# Altium project lilred_management_board.PrjPcb (part 2 of 2)

## Sheet current_sense.SchDoc
size Letter; CompanyName: Carnegie Mellon University; Organization: Carnegie Mellon University; Address1: Carnegie Mellon University; Address2: Robotics Institute; Address3: 5000 Forbes Ave., 4208 NSH; Address4: Pittsburgh, PA 15213; DocumentNumber: 4; Revision: 1.0; SheetNumber: 4; SheetTotal: 8; PageSetup: Record=PageOptions|CenterHorizontal=True|CenterVertical=True|PrintScale=1.00|XCorrection=1.00|YCorrection=1.00|PrintKind=0|BorderSize=5000000|LeftOffset=0|BottomOffset=0|Orientation=2|PaperLength=1000|PaperWidth=1000|Scale=100|PaperSource=7|PrintQuality=-4|MediaType=1|DitherType=10|PaperKind=Letter|PrintScaleMode=1
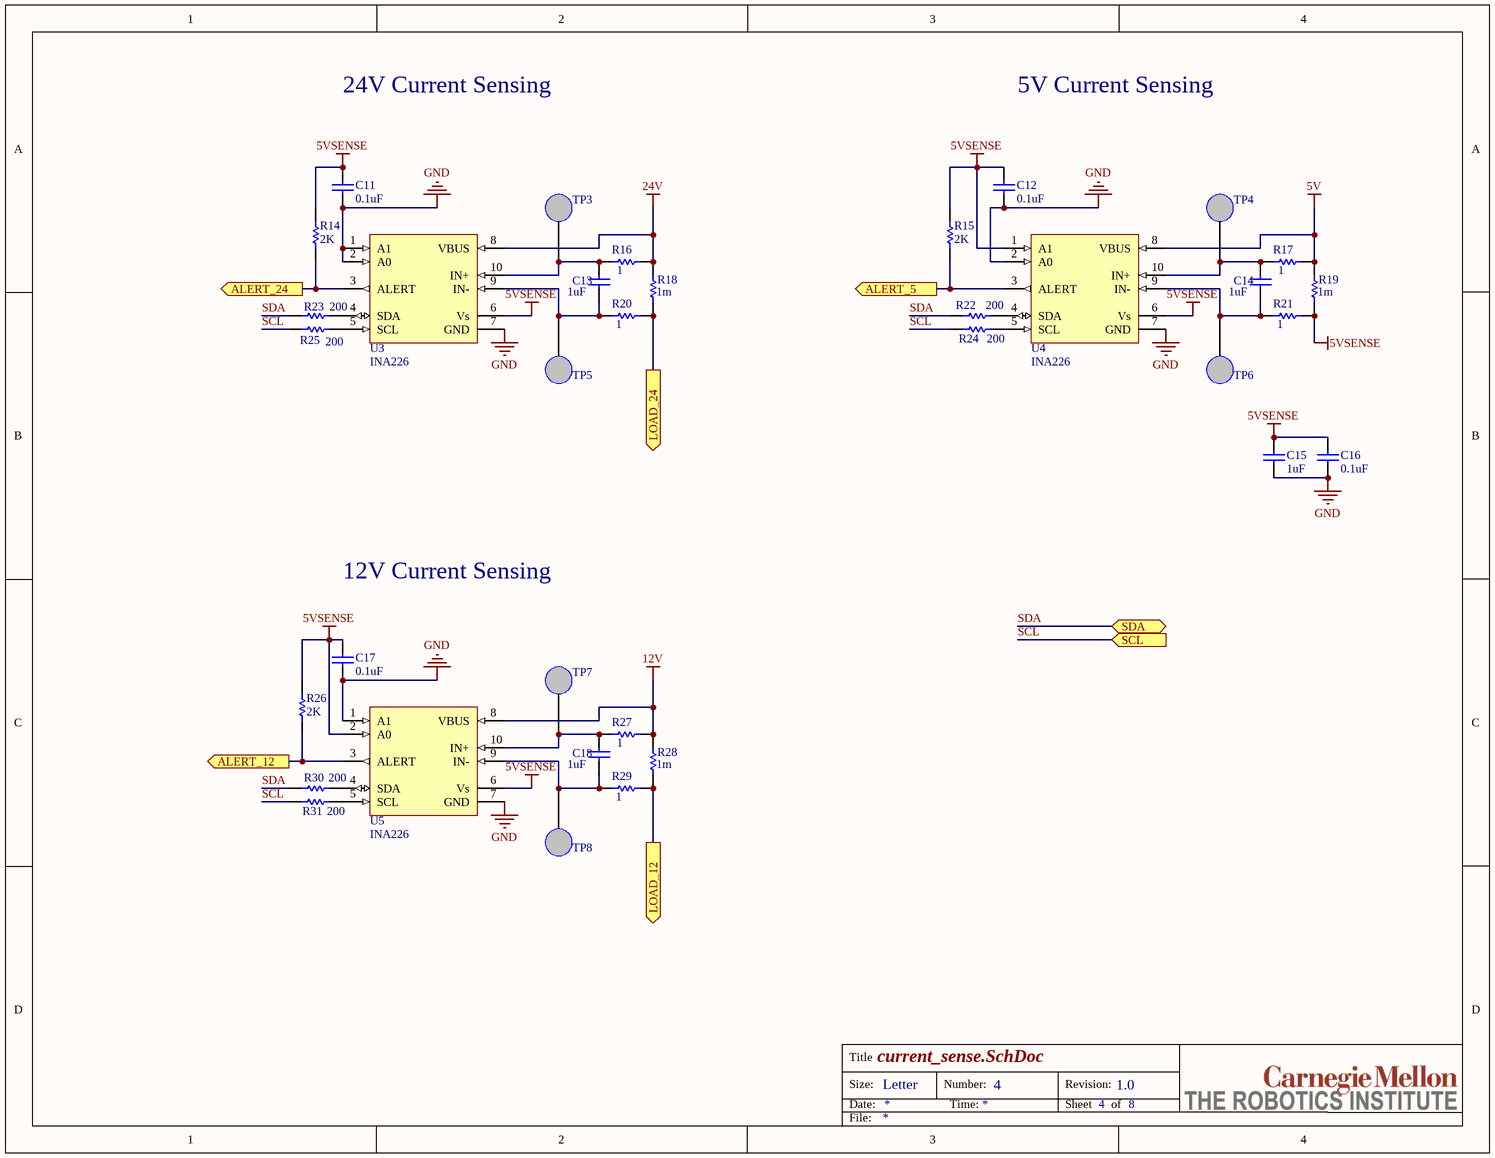
[diagram p2: current_sense.SchDoc]

### Parts
C11  value 0.1uF  [CAPC1608N]  (hidden comment: Bypass, 5V, 0.1uF)
C12  value 0.1uF  [CAPC1608N]  (hidden comment: Bypass, 5V, 0.1uF)
C13  1uF  [CAPC1608N]
C14  1uF  [CAPC1608N]
C15  value 1uF  [CAPC1608N]  (hidden comment: Bypass, 5V, 1uF)
C16  value 0.1uF  [CAPC1608N]  (hidden comment: Bypass, 5V, 0.1uF)
C17  value 0.1uF  [CAPC1608N]  (hidden comment: Bypass, 5V, 0.1uF)
C18  1uF  [CAPC1608N]
R14  2K  [RESC1608N]
R15  2K  [RESC1608N]
R16  1  [RESC1608N]
R17  1  [RESC1608N]
R18  value 1m  [RES5931]  (hidden comment: RSENSE, 24V, 1m)
R19  value 1m  [RESC3225N]  (hidden comment: RSENSE, 5V, 1m)
R20  1  [RESC1608N]
R21  1  [RESC1608N]
R22  200  [RESC1608N]
R23  200  [RESC1608N]
R24  200  [RESC1608N]
R25  200  [RESC1608N]
R26  2K  [RESC1608N]
R27  1  [RESC1608N]
R28  value 1m  [RESC3225N]  (hidden comment: RSENSE, 12V, 1m)
R29  1  [RESC1608N]
R30  200  [RESC1608N]
R31  200  [RESC1608N]
TP3  LOAD  [TestPoint]  (value not drawn)
TP4  SUPPLY  [TestPoint]  (value not drawn)
TP5  SUPPLY  [TestPoint]  (value not drawn)
TP6  LOAD  [TestPoint]  (value not drawn)
TP7  SUPPLY  [TestPoint]  (value not drawn)
TP8  LOAD  [TestPoint]  (value not drawn)
U3  INA226  [10-VSSOP]
U4  INA226  [10-VSSOP]
U5  INA226  [10-VSSOP]

### Ports
ALERT_5 (out), ALERT_12 (out), ALERT_24 (out), LOAD_12 (out), LOAD_24 (out), SCL (in), SDA (bidir)

### Nets
5V: R17.1 R19.2 U4.8(VBUS)
5VSENSE: C11.2 C12.2 C15.2 C16.2 C17.2 R14.1 R15.1 R19.1 R21.1 R26.1 U3.6(Vs) U4.1(A1) U4.6(Vs) U5.2(A0) U5.6(Vs)
12V: R27.1 R28.2 U5.8(VBUS)
24V: R16.1 R18.2 U3.8(VBUS)
GND: C11.1 C12.1 C15.1 C16.1 C17.1 U3.1(A1) U3.2(A0) U3.7(GND) U4.2(A0) U4.7(GND) U5.1(A1) U5.7(GND)
LOAD_12: R28.1 R29.1 ; port LOAD_12
LOAD_24: R18.1 R20.1 ; port LOAD_24
SCL: R24.2 R25.2 R31.2 ; port SCL
SDA: R22.2 R23.2 R30.2 ; port SDA
NetC13_1: C13.1 R16.2 TP3.1 U3.10(IN+)
NetC13_2: C13.2 R20.2 TP5.1 U3.9(IN-)
NetC14_1: C14.1 R17.2 TP4.1 U4.10(IN+)
NetC14_2: C14.2 R21.2 TP6.1 U4.9(IN-)
NetC18_1: C18.1 R27.2 TP7.1 U5.10(IN+)
NetC18_2: C18.2 R29.2 TP8.1 U5.9(IN-)
NetR14_2: R14.2 U3.3(ALERT) ; port ALERT_24
NetR15_2: R15.2 U4.3(ALERT) ; port ALERT_5
NetR22_1: R22.1 U4.4(SDA)
NetR23_1: R23.1 U3.4(SDA)
NetR24_1: R24.1 U4.5(SCL)
NetR25_1: R25.1 U3.5(SCL)
NetR26_2: R26.2 U5.3(ALERT) ; port ALERT_12
NetR30_1: R30.1 U5.4(SDA)
NetR31_1: R31.1 U5.5(SCL)

### Notes on the sheet
- 24V Current Sensing
- 5V Current Sensing
- 12V Current Sensing
- Title
- Size:
- Date:
- Letter
- Number:
- Time:
- Revision:
- Sheet
- of
- File:

### Library data of the parts
C11 C12 C16 C17 = Cap: Capacitor; Manufacturer: Murata Electronics North America; Manufacturer Part Number: GRM188R71H104JA93D; Description: CAP CER 0.1UF 50V X7R 0603; Capacitance: 0.10µF; Tolerance: ±5%; Voltage - Rated: 50V; Temperature Coefficient: X7R; Published: 8-Jun-2000; LatestRevisionDate: 17-Jul-2002; LatestRevisionNote: Re-released for DXP Platform.; PackageReference: RAD-0.3; Publisher: Altium Limited; PackageDescription: Radial Cap, Thru-Hole; 2 Leads; 0.3 in Pin Spacing; Supplier 1: Digi-Key; Supplier Part Number 1: 490-13406-1-ND; RoHS: RoHS Compliant; Category: Capacitors; Stock 1: 7465; Pricing 1: 1=0.11, 10=0.078, 50=0.0422, 100=0.0358, 250=0.02924, 500=0.02502, 1000=0.0195 (USD); Packaging: Cut Tape (CT); Mounting Type: Surface Mount, MLCC; Operating Temperature: -55°C ~ 125°C; Applications: General Purpose; Ratings: -; Package / Case: 0603 (1608 Metric); Size / Dimension: 0.063" L x 0.031" W (1.60mm x 0.80mm); Height - Seated (Max): -; Thickness (Max): 0.031" (0.80mm); Lead Spacing: -; Features: -; Lead Style: -; ComponentLink1URL: http://www.murata.com/~/media/webrenewal/support/library/catalog/products/capacitor/mlcc/c02e.pdf; ComponentLink1Description: http://www.murata.com/~/media/webrenewal/support/library/catalog/products/capacitor/mlcc/c02e.pdf
C13-C15 C18 = Cap: Capacitor; Manufacturer: Murata Electronics North America; Manufacturer Part Number: GRM188R61H105KAALD; Description: CAP CER 1UF 50V X5R 0603; Capacitance: 1µF; Tolerance: ±10%; Voltage - Rated: 50V; Temperature Coefficient: X5R; Published: 8-Jun-2000; LatestRevisionDate: 17-Jul-2002; LatestRevisionNote: Re-released for DXP Platform.; PackageReference: RAD-0.3; Publisher: Altium Limited; PackageDescription: Radial Cap, Thru-Hole; 2 Leads; 0.3 in Pin Spacing; Supplier 1: Digi-Key; Supplier Part Number 1: 490-10732-1-ND; RoHS: RoHS Compliant; Category: Capacitors; Stock 1: 59223; Pricing 1: 1=0.17, 10=0.12, 50=0.069, 100=0.057, 250=0.048, 500=0.0402, 1000=0.033 (USD); Packaging: Cut Tape (CT); Mounting Type: Surface Mount, MLCC; Operating Temperature: -55°C ~ 85°C; Applications: General Purpose; Ratings: -; Package / Case: 0603 (1608 Metric); Size / Dimension: 0.063" L x 0.031" W (1.60mm x 0.80mm); Height - Seated (Max): -; Thickness (Max): 0.035" (0.90mm); Lead Spacing: -; Features: -; Lead Style: -; ComponentLink1URL: http://www.murata.com/~/media/webrenewal/support/library/catalog/products/capacitor/mlcc/c02e.pdf; ComponentLink1Description: http://www.murata.com/~/media/webrenewal/support/library/catalog/products/capacitor/mlcc/c02e.pdf
  C13 C14 C18: Value: 1uF
R14 R15 R26 = Res1: Resistor; Manufacturer: Yageo; Manufacturer Part Number: RC0603JR-072KL; Description: RES SMD 2K OHM 5% 1/10W 0603; Tolerance: ±5%; Power (Watts): 0.1W, 1/10W; Temperature Coefficient: ±100ppm/°C; Published: 8-Jun-2000; LatestRevisionDate: 17-Jul-2002; LatestRevisionNote: Re-released for DXP Platform.; PackageReference: AXIAL-0.3; Publisher: Altium Limited; PackageDescription: Axial Device, Thru-Hole; 2 Leads; 0.3 in Pin Spacing; Value: 2K; Supplier 1: Digi-Key; Supplier Part Number 1: 311-2.0KGRCT-ND; RoHS: RoHS Compliant; Category: Resistors; Stock 1: 411222; Pricing 1: 1=0.1, 10=0.011, 25=0.008, 100=0.0044, 250=0.00336, 500=0.0027, 1000=0.00198, 2500=0.00172 (USD); Packaging: Cut Tape (CT); Resistance (Ohms): 2k; Composition: Thick Film; Features: Moisture Resistant; Operating Temperature: -55°C ~ 155°C; Package / Case: 0603 (1608 Metric); Supplier Device Package: 0603; Size / Dimension: 0.063" L x 0.031" W (1.60mm x 0.80mm); Height: 0.022" (0.55mm); Number of Terminations: 2; ComponentLink1URL: http://www.yageo.com/documents/recent/PYu-RC_Group_51_RoHS_L_04.pdf; ComponentLink1Description: http://www.yageo.com/documents/recent/PYu-RC_Group_51_RoHS_L_04.pdf
R16 R17 R20 R21 R27 R29 = Res1: Resistor; Manufacturer: Yageo; Manufacturer Part Number: RC0603FR-071RL; Description: RES SMD 1 OHM 1% 1/10W 0603; Tolerance: ±1%; Power (Watts): 0.1W, 1/10W; Temperature Coefficient: ±200ppm/°C; Published: 8-Jun-2000; LatestRevisionDate: 17-Jul-2002; LatestRevisionNote: Re-released for DXP Platform.; PackageReference: AXIAL-0.3; Publisher: Altium Limited; PackageDescription: Axial Device, Thru-Hole; 2 Leads; 0.3 in Pin Spacing; Value: 1; Supplier 1: Digi-Key; Supplier Part Number 1: 311-1.00HRCT-ND; RoHS: RoHS Compliant; Category: Resistors; Stock 1: 113321; Pricing 1: 1=0.1, 10=0.02, 25=0.0144, 100=0.0082, 250=0.00624, 500=0.00498, 1000=0.00367, 2500=0.00319 (USD); Packaging: Cut Tape (CT); Resistance (Ohms): 1; Composition: Thick Film; Features: Moisture Resistant; Operating Temperature: -55°C ~ 155°C; Package / Case: 0603 (1608 Metric); Supplier Device Package: 0603; Size / Dimension: 0.063" L x 0.031" W (1.60mm x 0.80mm); Height: 0.022" (0.55mm); Number of Terminations: 2; ComponentLink1URL: http://www.yageo.com/documents/recent/PYu-RC_Group_51_RoHS_L_04.pdf; ComponentLink1Description: http://www.yageo.com/documents/recent/PYu-RC_Group_51_RoHS_L_04.pdf
R18 = Res1: Resistor; Manufacturer: Rohm Semiconductor; Manufacturer Part Number: PSR500HTQFH1L00; Description: RES SMD 0.001 OHM 1% 5W 5931; Resistance (Ohms): 0.001; Tolerance: ±1%; Power (Watts): 5W; Temperature Coefficient: ±75ppm/°C; Published: 8-Jun-2000; LatestRevisionDate: 17-Jul-2002; LatestRevisionNote: Re-released for DXP Platform.; PackageReference: AXIAL-0.3; Publisher: Altium Limited; PackageDescription: Axial Device, Thru-Hole; 2 Leads; 0.3 in Pin Spacing; Supplier 1: Digi-Key; Supplier Part Number 1: RHM1683-CT-ND; RoHS: RoHS Compliant; Category: Resistors; Stock 1: 2625; Pricing 1: 1=1.96, 10=1.736, 25=1.61, 100=1.3259, 250=1.13652, 500=0.9471, 1000=0.82082 (USD); Packaging: Cut Tape (CT); Composition: Metal Element; Features: Automotive AEC-Q200, Current Sense; Operating Temperature: -55°C ~ 170°C; Package / Case: 5931; Supplier Device Package: 5931; Size / Dimension: 0.591" L x 0.305" W (15.00mm x 7.75mm); Height: -; Number of Terminations: 2; ComponentLink1URL: http://rohmfs.rohm.com/en/products/databook/datasheet/passive/resistor/chip_resistor/psr.pdf; ComponentLink1Description: http://rohmfs.rohm.com/en/products/databook/datasheet/passive/resistor/chip_resistor/psr.pdf
R19 R28 = Res1: Resistor; Manufacturer: Rohm Semiconductor; Manufacturer Part Number: PMR25HZPFV1L00; Description: RES SMD 0.001 OHM 1% 1W 1210; Resistance (Ohms): 0.001; Tolerance: ±1%; Power (Watts): 1W; Temperature Coefficient: ±100ppm/°C; Published: 8-Jun-2000; LatestRevisionDate: 17-Jul-2002; LatestRevisionNote: Re-released for DXP Platform.; PackageReference: AXIAL-0.3; Publisher: Altium Limited; PackageDescription: Axial Device, Thru-Hole; 2 Leads; 0.3 in Pin Spacing; Supplier 1: Digi-Key; Supplier Part Number 1: RHM.001APCT-ND; RoHS: RoHS Compliant; Category: Resistors; Stock 1: 2836; Pricing 1: 1=0.64, 10=0.535, 25=0.4588, 100=0.3593, 250=0.32108, 500=0.25994, 1000=0.21024 (USD); Packaging: Cut Tape (CT); Composition: Thick Film; Features: Automotive AEC-Q200, Current Sense; Operating Temperature: -55°C ~ 155°C; Package / Case: 1210 (3225 Metric); Supplier Device Package: 1210 (3225 Metric); Size / Dimension: 0.126" L x 0.098" W (3.20mm x 2.50mm); Height: 0.026" (0.67mm); Number of Terminations: 2; ComponentLink1URL: http://rohmfs.rohm.com/en/products/databook/datasheet/passive/resistor/chip_resistor/pmr.pdf; ComponentLink1Description: http://rohmfs.rohm.com/en/products/databook/datasheet/passive/resistor/chip_resistor/pmr.pdf
R22-R25 R30 R31 = Res1: Resistor; Manufacturer: Yageo; Manufacturer Part Number: RC0603JR-07200RL; Description: RES SMD 200 OHM 5% 1/10W 0603; Tolerance: ±5%; Power (Watts): 0.1W, 1/10W; Temperature Coefficient: ±100ppm/°C; Published: 8-Jun-2000; LatestRevisionDate: 17-Jul-2002; LatestRevisionNote: Re-released for DXP Platform.; PackageReference: AXIAL-0.3; Publisher: Altium Limited; PackageDescription: Axial Device, Thru-Hole; 2 Leads; 0.3 in Pin Spacing; Value: 200; Supplier 1: Digi-Key; Supplier Part Number 1: 311-200GRCT-ND; RoHS: RoHS Compliant; Category: Resistors; Stock 1: 267996; Pricing 1: 1=0.1, 10=0.011, 25=0.008, 100=0.0044, 250=0.00336, 500=0.0027, 1000=0.00198, 2500=0.00172 (USD); Packaging: Cut Tape (CT); Resistance (Ohms): 200; Composition: Thick Film; Features: Moisture Resistant; Operating Temperature: -55°C ~ 155°C; Package / Case: 0603 (1608 Metric); Supplier Device Package: 0603; Size / Dimension: 0.063" L x 0.031" W (1.60mm x 0.80mm); Height: 0.022" (0.55mm); Number of Terminations: 2; ComponentLink1URL: http://www.yageo.com/documents/recent/PYu-RC_Group_51_RoHS_L_04.pdf; ComponentLink1Description: http://www.yageo.com/documents/recent/PYu-RC_Group_51_RoHS_L_04.pdf
TP3-TP8 = Ring_Terminal: Test Point
U3-U5 = INA226: Current Shunt Monitor - I2C Interface; Manufacturer: Texas Instruments; Manufacturer Part Number: INA226AIDGSR; Description: IC MONITOR PWR/CURR BIDIR 10MSOP; Function: Current Monitor; Sensing Method: High/Low-Side; Accuracy: ±0.02%; Voltage - Input: 0 V ~ 36 V; Current - Output: 10mA; Supplier 1: Digi-Key; Supplier Part Number 1: 296-29034-1-ND; RoHS: RoHS Compliant; Category: Integrated Circuits (ICs); Stock 1: 16599; Pricing 1: 1=3.44, 10=3.087, 100=2.5326, 500=2.1546, 1000=1.575 (USD); Packaging: Cut Tape (CT); Operating Temperature: -40°C ~ 125°C; Mounting Type: Surface Mount; Package / Case: 10-TFSOP, 10-MSOP (0.118", 3.00mm Width); Supplier Device Package: 10-VSSOP; ComponentLink1URL: http://www.ti.com/lit/ds/symlink/ina226.pdf; ComponentLink1Description: http://www.ti.com/lit/ds/symlink/ina226.pdf

## Sheet thermal_monitor.SchDoc
size Letter; CompanyName: Carnegie Mellon University; Organization: Carnegie Mellon University; Address1: Carnegie Mellon University; Address2: Robotics Institute; Address3: 5000 Forbes Ave., 4208 NSH; Address4: Pittsburgh, PA 15213; DocumentNumber: 7; Revision: 1.0; SheetNumber: 7; SheetTotal: 8; PageSetup: Record=PageOptions|CenterHorizontal=True|CenterVertical=True|PrintScale=1.00|XCorrection=1.00|YCorrection=1.00|PrintKind=0|BorderSize=5000000|LeftOffset=0|BottomOffset=0|Orientation=2|PaperLength=1000|PaperWidth=1000|Scale=100|PaperSource=7|PrintQuality=-4|MediaType=1|DitherType=10|PaperKind=Letter|PrintScaleMode=1
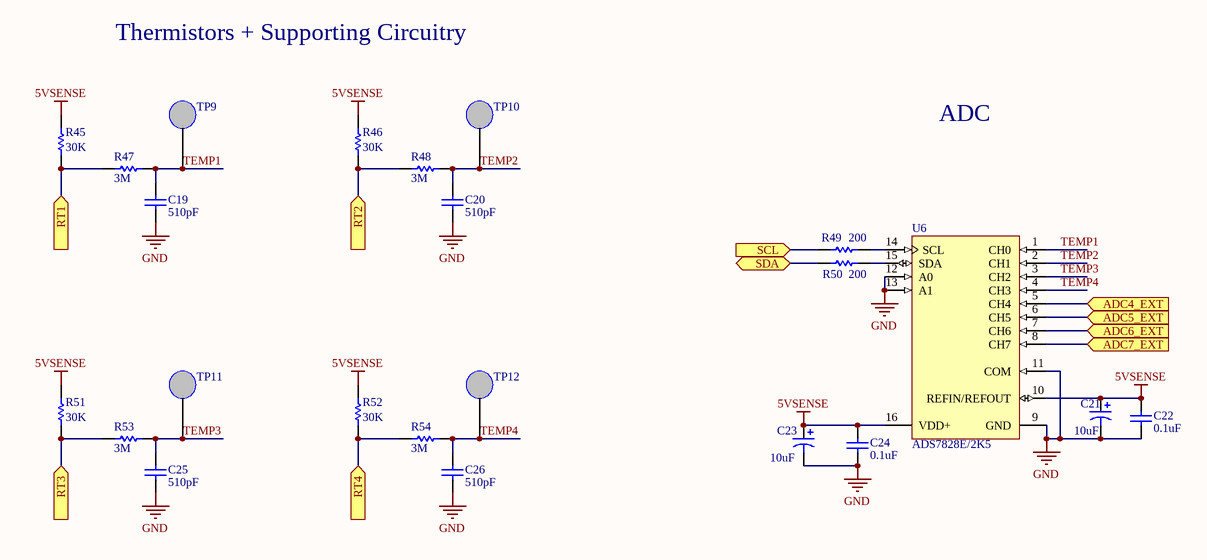
[diagram p3: thermal_monitor.SchDoc]

### Parts
C19  510pF  [CAPC1608N]
C20  510pF  [CAPC1608N]
C21  value 10uF  [CAPC2012N]  (hidden comment: Bypass Tanatalum, 5V, 10uF)
C22  value 0.1uF  [CAPC1608N]  (hidden comment: Bypass, 5V, 10nF)
C23  value 10uF  [CAPC2012N]  (hidden comment: Bypass Tantalum, 5V, 10uF)
C24  value 0.1uF  [CAPC1608N]  (hidden comment: Bypass, 5V, 10nF)
C25  510pF  [CAPC1608N]
C26  510pF  [CAPC1608N]
R45  value 30K  [RESC1608N]  (hidden comment: Therm_Rp, 30K)
R46  value 30K  [RESC1608N]  (hidden comment: Therm_Rp, 30K)
R47  3M  [RESC1608N]
R48  3M  [RESC1608N]
R49  200  [RESC1608N]
R50  200  [RESC1608N]
R51  value 30K  [RESC1608N]  (hidden comment: Therm_Rp, 30K)
R52  value 30K  [RESC1608N]  (hidden comment: Therm_Rp, 30K)
R53  3M  [RESC1608N]
R54  3M  [RESC1608N]
TP9  RT1  [TestPoint]  (value not drawn)
TP10  RT2  [TestPoint]  (value not drawn)
TP11  RT3  [TestPoint]  (value not drawn)
TP12  RT4  [TestPoint]  (value not drawn)
U6  ADS7828E/2K5  [TI-PW16_N]

### Ports
ADC4_EXT (in), ADC5_EXT (in), ADC6_EXT (in), ADC7_EXT (in), RT1 (in), RT2 (in), RT3 (in), RT4 (in), SCL (in), SDA (bidir)

### Nets
5VSENSE: C21.1 C22.2 C23.1 C24.2 R45.2 R46.2 R51.2 R52.2 U6.10(REFIN/REFOUT) U6.16(VDD+)
GND: C19.1 C20.1 C21.2 C22.1 C23.2 C24.1 C25.1 C26.1 U6.9(GND) U6.11(COM) U6.12(A0) U6.13(A1)
ADC4_EXT: U6.5(CH4) ; port ADC4_EXT
ADC5_EXT: U6.6(CH5) ; port ADC5_EXT
ADC6_EXT: U6.7(CH6) ; port ADC6_EXT
ADC7_EXT: U6.8(CH7) ; port ADC7_EXT
RT1: R45.1 R47.2 ; port RT1
RT2: R46.1 R48.2 ; port RT2
RT3: R51.1 R53.2 ; port RT3
RT4: R52.1 R54.2 ; port RT4
SCL: R49.1 ; port SCL
SDA: R50.1 ; port SDA
TEMP1: C19.2 R47.1 TP9.1 U6.1(CH0)
TEMP2: C20.2 R48.1 TP10.1 U6.2(CH1)
TEMP3: C25.2 R53.1 TP11.1 U6.3(CH2)
TEMP4: C26.2 R54.1 TP12.1 U6.4(CH3)
NetR49_2: R49.2 U6.14(SCL)
NetR50_2: R50.2 U6.15(SDA)

### Notes on the sheet
- Thermistors + Supporting Circuitry
- ADC
- Title
- Size:
- Date:
- Letter
- Number:
- Time:
- Revision:
- Sheet
- of
- File:

### Library data of the parts
C19 C20 C25 C26 = Cap: Capacitor; Manufacturer: Murata Electronics North America; Manufacturer Part Number: GRM1885C2A511JA01D; Description: CAP CER 510PF 100V NP0 0603; Tolerance: ±5%; Voltage - Rated: 100V; Temperature Coefficient: C0G, NP0; Published: 8-Jun-2000; LatestRevisionDate: 17-Jul-2002; LatestRevisionNote: Re-released for DXP Platform.; PackageReference: RAD-0.3; Publisher: Altium Limited; PackageDescription: Radial Cap, Thru-Hole; 2 Leads; 0.3 in Pin Spacing; Value: 510pF; Supplier 1: Digi-Key; Supplier Part Number 1: 490-1368-1-ND; RoHS: RoHS Compliant; Category: Capacitors; Stock 1: 12986; Pricing 1: 1=0.18, 10=0.122, 25=0.0916, 50=0.0702, 100=0.058, 250=0.0488, 500=0.04088, 1000=0.03355 (USD); Packaging: Cut Tape (CT); Capacitance: 510pF; Mounting Type: Surface Mount, MLCC; Operating Temperature: -55°C ~ 125°C; Applications: General Purpose; Ratings: -; Package / Case: 0603 (1608 Metric); Size / Dimension: 0.063" L x 0.031" W (1.60mm x 0.80mm); Height - Seated (Max): -; Thickness (Max): 0.035" (0.90mm); Lead Spacing: -; Features: -; Lead Style: -; ComponentLink1URL: http://www.murata.com/~/media/webrenewal/support/library/catalog/products/capacitor/mlcc/c02e.pdf; ComponentLink1Description: http://www.murata.com/~/media/webrenewal/support/library/catalog/products/capacitor/mlcc/c02e.pdf
C21 C23 = Cap Pol1: Polarized Capacitor (Radial); Manufacturer: AVX Corporation; Manufacturer Part Number: TACL106M010RTA; Manufacturer Size Code: L; Capacitance: 10µF; Tolerance: ±20%; Voltage - Rated: 10V; ESR (Equivalent Series Resistance): 7.5 Ohm; Type: Molded; Description: CAP TANT 10UF 6.3V 20% 0805; Published: 8-Jun-2000; LatestRevisionDate: 17-Jul-2002; LatestRevisionNote: Re-released for DXP Platform.; PackageReference: RB7.6-15; Publisher: Altium Limited; PackageDescription: Polarized Capacitor (Radial); 2 Leads; Supplier 1: Digi-Key; Supplier Part Number 1: 478-6230-1-ND; RoHS: RoHS Compliant; Category: Capacitors; Stock 1: 13074; Pricing 1: 1=2.24, 10=1.836, 100=1.2983, 250=1.07448, 500=0.96256, 1000=0.8954 (USD); Packaging: Cut Tape (CT); Operating Temperature: -55°C ~ 125°C; Mounting Type: Surface Mount; Package / Case: 0603 (1608 Metric); Size / Dimension: 0.063" L x 0.033" W (1.60mm x 0.85mm); Height - Seated (Max): 0.039" (1.00mm); Lead Spacing: -; Features: General Purpose; Lifetime @ Temp.: -; ComponentLink1URL: http://datasheets.avx.com/TAC.pdf; ComponentLink1Description: http://datasheets.avx.com/TAC.pdf; Supplier 2: Digi-Key; Supplier Part Number 2: 478-8115-1-ND; Stock 2: 38138; Pricing 2: 1=0.37, 10=0.312, 100=0.156, 250=0.117, 500=0.10336, 1000=0.09165 (USD); ComponentLink2URL: http://datasheets.avx.com/f92.pdf; ComponentLink2Description: http://datasheets.avx.com/f92.pdf
C22 C24 = Cap: as C11 on sheet current_sense; Published: 8-Jun-2000; LatestRevisionDate: 17-Jul-2002; LatestRevisionNote: Re-released for DXP Platform.; PackageReference: RAD-0.3; Publisher: Altium Limited; PackageDescription: Radial Cap, Thru-Hole; 2 Leads; 0.3 in Pin Spacing; Supplier 1: Digi-Key; Supplier Part Number 1: 490-13406-1-ND; RoHS: RoHS Compliant; Category: Capacitors; Stock 1: 7465; Pricing 1: 1=0.11, 10=0.078, 50=0.0422, 100=0.0358, 250=0.02924, 500=0.02502, 1000=0.0195 (USD); Packaging: Cut Tape (CT); Mounting Type: Surface Mount, MLCC; Operating Temperature: -55°C ~ 125°C; Applications: General Purpose; Ratings: -; Package / Case: 0603 (1608 Metric); Size / Dimension: 0.063" L x 0.031" W (1.60mm x 0.80mm); Height - Seated (Max): -; Thickness (Max): 0.031" (0.80mm); Lead Spacing: -; Features: -; Lead Style: -; ComponentLink1URL: http://www.murata.com/~/media/webrenewal/support/library/catalog/products/capacitor/mlcc/c02e.pdf; ComponentLink1Description: http://www.murata.com/~/media/webrenewal/support/library/catalog/products/capacitor/mlcc/c02e.pdf
R45 R46 R51 R52 = Res1: Resistor; Manufacturer: Yageo; Manufacturer Part Number: RT0603DRD0730KL; Description: RES SMD 30K OHM 0.5% 1/10W 0603; Tolerance: ±0.5%; Power (Watts): 0.1W, 1/10W; Temperature Coefficient: ±25ppm/°C; Published: 8-Jun-2000; LatestRevisionDate: 17-Jul-2002; LatestRevisionNote: Re-released for DXP Platform.; PackageReference: AXIAL-0.3; Publisher: Altium Limited; PackageDescription: Axial Device, Thru-Hole; 2 Leads; 0.3 in Pin Spacing; Supplier 1: Digi-Key; Supplier Part Number 1: 311-30KDCT-ND; RoHS: RoHS Compliant; Category: Resistors; Stock 1: 26965; Pricing 1: 1=0.22, 10=0.184, 25=0.134, 100=0.0721, 250=0.05532, 500=0.04358, 1000=0.03018, 2500=0.02766 (USD); Packaging: Cut Tape (CT); Resistance (Ohms): 30k; Composition: Thin Film; Features: Moisture Resistant; Operating Temperature: -55°C ~ 155°C; Package / Case: 0603 (1608 Metric); Supplier Device Package: 0603; Size / Dimension: 0.063" L x 0.031" W (1.60mm x 0.80mm); Height: 0.022" (0.55mm); Number of Terminations: 2; ComponentLink1URL: http://www.yageo.com/documents/recent/PYu-RT_1-to-0.05_RoHS_L_6.pdf; ComponentLink1Description: http://www.yageo.com/documents/recent/PYu-RT_1-to-0.05_RoHS_L_6.pdf
R47 R48 R53 R54 = Res1: Resistor; Manufacturer: Yageo; Manufacturer Part Number: RC0603JR-073ML; Description: RES SMD 3M OHM 5% 1/10W 0603; Tolerance: ±5%; Power (Watts): 0.1W, 1/10W; Temperature Coefficient: ±100ppm/°C; Published: 8-Jun-2000; LatestRevisionDate: 17-Jul-2002; LatestRevisionNote: Re-released for DXP Platform.; PackageReference: AXIAL-0.3; Publisher: Altium Limited; PackageDescription: Axial Device, Thru-Hole; 2 Leads; 0.3 in Pin Spacing; Value: 3M; Supplier 1: Digi-Key; Supplier Part Number 1: 311-3.0MGRCT-ND; RoHS: RoHS Compliant; Category: Resistors; Stock 1: 60830; Pricing 1: 1=0.1, 10=0.011, 25=0.008, 100=0.0044, 250=0.00336, 500=0.0027, 1000=0.00198, 2500=0.00172 (USD); Packaging: Cut Tape (CT); Resistance (Ohms): 3M; Composition: Thick Film; Features: Moisture Resistant; Operating Temperature: -55°C ~ 155°C; Package / Case: 0603 (1608 Metric); Supplier Device Package: 0603; Size / Dimension: 0.063" L x 0.031" W (1.60mm x 0.80mm); Height: 0.022" (0.55mm); Number of Terminations: 2; ComponentLink1URL: http://www.yageo.com/documents/recent/PYu-RC_Group_51_RoHS_L_04.pdf; ComponentLink1Description: http://www.yageo.com/documents/recent/PYu-RC_Group_51_RoHS_L_04.pdf
R49 R50 = Res1: as R22 on sheet current_sense; Published: 8-Jun-2000; LatestRevisionDate: 17-Jul-2002; LatestRevisionNote: Re-released for DXP Platform.; PackageReference: AXIAL-0.3; Publisher: Altium Limited; PackageDescription: Axial Device, Thru-Hole; 2 Leads; 0.3 in Pin Spacing; Value: 200; Supplier 1: Digi-Key; Supplier Part Number 1: 311-200GRCT-ND; RoHS: RoHS Compliant; Category: Resistors; Stock 1: 267996; Pricing 1: 1=0.1, 10=0.011, 25=0.008, 100=0.0044, 250=0.00336, 500=0.0027, 1000=0.00198, 2500=0.00172 (USD); Packaging: Cut Tape (CT); Resistance (Ohms): 200; Composition: Thick Film; Features: Moisture Resistant; Operating Temperature: -55°C ~ 155°C; Package / Case: 0603 (1608 Metric); Supplier Device Package: 0603; Size / Dimension: 0.063" L x 0.031" W (1.60mm x 0.80mm); Height: 0.022" (0.55mm); Number of Terminations: 2; ComponentLink1URL: http://www.yageo.com/documents/recent/PYu-RC_Group_51_RoHS_L_04.pdf; ComponentLink1Description: http://www.yageo.com/documents/recent/PYu-RC_Group_51_RoHS_L_04.pdf
TP9-TP12 = Ring_Terminal: Test Point
U6 = ADS7828E/2K5: 12-Bit 50 kSPS ADC I2C Low Power 8-Channel Multiplexer Internal 2.5 V Reference, -40 to 85 degC, 16-pin SOP (PW16), Green (RoHS & no Sb/Br); Manufacturer: Texas Instruments; Description: IC ADC 12BIT 50KSPS 8CH 16-TSSOP; Number of Bits: 12; Sampling Rate (Per Second): 50k; Number of Inputs: 8; Input Type: Differential, Single Ended; Data Interface: I²C; Configuration: MUX-S/H-ADC; Ratio - S/H:ADC: 1:1; Number of A/D Converters: 1; Architecture: SAR; Reference Type: External, Internal; Voltage - Supply, Analog: 2.7 V ~ 3.6 V, 5V; Supplier 1: Digi-Key; Supplier Part Number 1: 296-38856-1-ND; Manufacturer Part Number: ADS7828E/2K5; RoHS: RoHS Compliant By Exemption; Category: Integrated Circuits (ICs); Stock 1: 3104; Pricing 1: 1=7.39, 10=6.693, 100=5.5175, 500=4.824, 1000=3.76875 (USD); Packaging: Cut Tape (CT); Voltage - Supply, Digital: 2.7 V ~ 3.6 V, 5V; Features: -; Operating Temperature: -40°C ~ 85°C; Package / Case: 16-TSSOP (0.173", 4.40mm Width); Supplier Device Package: 16-TSSOP; ComponentLink1URL: http://www.ti.com/lit/ds/symlink/ads7828.pdf; ComponentLink1Description: http://www.ti.com/lit/ds/symlink/ads7828.pdf

## Sheet led_control.SchDoc
size Letter; CompanyName: Carnegie Mellon University; Organization: Carnegie Mellon University; Address1: Carnegie Mellon University; Address2: Robotics Institute; Address3: 5000 Forbes Ave., 4208 NSH; Address4: Pittsburgh, PA 15213; DocumentNumber: 5; Revision: 1.0; SheetNumber: 5; SheetTotal: 8; PageSetup: Record=PageOptions|CenterHorizontal=True|CenterVertical=True|PrintScale=1.00|XCorrection=1.00|YCorrection=1.00|PrintKind=0|BorderSize=5000000|LeftOffset=0|BottomOffset=0|Orientation=2|PaperLength=1000|PaperWidth=1000|Scale=100|PaperSource=7|PrintQuality=-4|MediaType=1|DitherType=10|PaperKind=Letter|PrintScaleMode=1
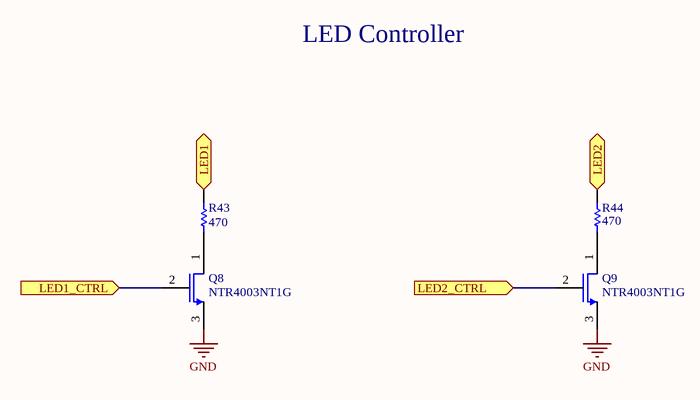
[diagram p4: led_control.SchDoc]

### Parts
Q8  NTR4003NT1G  [SOT-23]
Q9  NTR4003NT1G  [SOT-23]
R43  470  [RESC1608N]
R44  470  [RESC1608N]

### Ports
LED1 (in), LED1_CTRL (in), LED2 (in), LED2_CTRL (in)

### Nets
GND: Q8.3 Q9.3
LED1: R43.1 ; port LED1
LED2: R44.2 ; port LED2
NetQ8_1: Q8.1 R43.2
NetQ8_2: Q8.2 ; port LED1_CTRL
NetQ9_1: Q9.1 R44.1
NetQ9_2: Q9.2 ; port LED2_CTRL

### Notes on the sheet
- LED Controller
- Title
- Size:
- Date:
- Letter
- Number:
- Time:
- Revision:
- Sheet
- of
- File:

### Library data of the parts
Q8 Q9 = NTR4003NT1G: N-Channel MOSFET; pin to pad: 1>3 2>1 3>2; Manufacturer: ON Semiconductor; Description: MOSFET N-CH 30V 500MA SOT-23; FET Type: MOSFET N-Channel, Metal Oxide; FET Feature: Standard; Drain to Source Voltage (Vdss): 30V; Current - Continuous Drain (Id) @ 25°C: 500mA (Ta); Rds On (Max) @ Id, Vgs: 1.5 Ohm @ 10mA, 4V; Vgs(th) (Max) @ Id: 1.4V @ 250µA; Gate Charge (Qg) @ Vgs: 1.15nC @ 5V; Input Capacitance (Ciss) @ Vds: 21pF @ 5V; Power - Max: 690mW; Supplier 1: Digi-Key; Supplier Part Number 1: NTR4003NT1GOSCT-ND; Manufacturer Part Number: NTR4003NT1G; RoHS: RoHS Compliant; Category: Discrete Semiconductor Products; Stock 1: 65978; Pricing 1: 1=0.27, 10=0.223, 100=0.118, 500=0.07758, 1000=0.05286 (USD); Packaging: Cut Tape (CT); Operating Temperature: -55°C ~ 150°C (TJ); Mounting Type: Surface Mount; Package / Case: TO-236-3, SC-59, SOT-23-3; Supplier Device Package: SOT-23-3 (TO-236); ComponentLink1URL: http://www.onsemi.com/pub_link/Collateral/NTR4003N-D.PDF; ComponentLink1Description: http://www.onsemi.com/pub_link/Collateral/NTR4003N-D.PDF
R43 R44 = Res1: Resistor; Manufacturer: Yageo; Manufacturer Part Number: RC0603JR-07470RL; Description: RES SMD 470 OHM 5% 1/10W 0603; Tolerance: ±5%; Power (Watts): 0.1W, 1/10W; Temperature Coefficient: ±100ppm/°C; Published: 8-Jun-2000; LatestRevisionDate: 17-Jul-2002; LatestRevisionNote: Re-released for DXP Platform.; PackageReference: AXIAL-0.3; Publisher: Altium Limited; PackageDescription: Axial Device, Thru-Hole; 2 Leads; 0.3 in Pin Spacing; Value: 470; Supplier 1: Digi-Key; Supplier Part Number 1: 311-470GRCT-ND; RoHS: RoHS Compliant; Category: Resistors; Stock 1: 674624; Pricing 1: 1=0.1, 10=0.011, 25=0.008, 100=0.0044, 250=0.00336, 500=0.0027, 1000=0.00198, 2500=0.00172 (USD); Packaging: Cut Tape (CT); Resistance (Ohms): 470; Composition: Thick Film; Features: Moisture Resistant; Operating Temperature: -55°C ~ 155°C; Package / Case: 0603 (1608 Metric); Supplier Device Package: 0603; Size / Dimension: 0.063" L x 0.031" W (1.60mm x 0.80mm); Height: 0.022" (0.55mm); Number of Terminations: 2; ComponentLink1URL: http://www.yageo.com/documents/recent/PYu-RC_Group_51_RoHS_L_04.pdf; ComponentLink1Description: http://www.yageo.com/documents/recent/PYu-RC_Group_51_RoHS_L_04.pdf

## Sheet fan_control.SchDoc
size Letter; CompanyName: Carnegie Mellon University; Organization: Carnegie Mellon University; Address1: Carnegie Mellon University; Address2: Robotics Institute; Address3: 5000 Forbes Ave., 4208 NSH; Address4: Pittsburgh, PA 15213; DocumentNumber: 6; Revision: 1.0; SheetNumber: 6; SheetTotal: 8; PageSetup: Record=PageOptions|CenterHorizontal=True|CenterVertical=True|PrintScale=1.00|XCorrection=1.00|YCorrection=1.00|PrintKind=0|BorderSize=5000000|LeftOffset=0|BottomOffset=0|Orientation=2|PaperLength=1000|PaperWidth=1000|Scale=100|PaperSource=7|PrintQuality=-4|MediaType=1|DitherType=10|PaperKind=Letter|PrintScaleMode=1
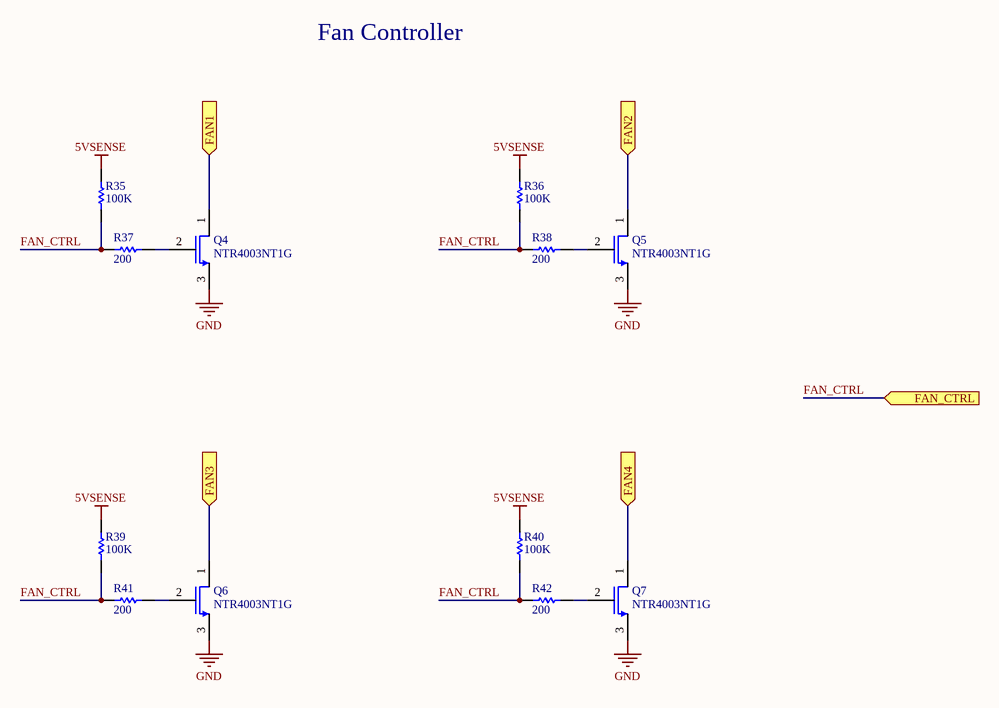
[diagram p5: fan_control.SchDoc]

### Parts
Q4  NTR4003NT1G  [SOT-23]
Q5  NTR4003NT1G  [SOT-23]
Q6  NTR4003NT1G  [SOT-23]
Q7  NTR4003NT1G  [SOT-23]
R35  100K  [RESC1608N]
R36  100K  [RESC1608N]
R37  200  [RESC1608N]
R38  200  [RESC1608N]
R39  100K  [RESC1608N]
R40  100K  [RESC1608N]
R41  200  [RESC1608N]
R42  200  [RESC1608N]

### Ports
FAN1 (in), FAN2 (in), FAN3 (in), FAN4 (in), FAN_CTRL (in)

### Nets
5VSENSE: R35.2 R36.2 R39.2 R40.2
GND: Q4.3 Q5.3 Q6.3 Q7.3
FAN1: Q4.1 ; port FAN1
FAN2: Q5.1 ; port FAN2
FAN3: Q6.1 ; port FAN3
FAN4: Q7.1 ; port FAN4
FAN_CTRL: R35.1 R36.1 R37.2 R38.2 R39.1 R40.1 R41.2 R42.2 ; port FAN_CTRL
NetQ4_2: Q4.2 R37.1
NetQ5_2: Q5.2 R38.1
NetQ6_2: Q6.2 R41.1
NetQ7_2: Q7.2 R42.1

### Notes on the sheet
- Fan Controller
- Title
- Size:
- Date:
- Letter
- Number:
- Time:
- Revision:
- Sheet
- of
- File:

### Library data of the parts
Q4-Q7 = NTR4003NT1G: N-Channel MOSFET; pin to pad: 1>3 2>1 3>2; Manufacturer: ON Semiconductor; Description: MOSFET N-CH 30V 500MA SOT-23; FET Type: MOSFET N-Channel, Metal Oxide; FET Feature: Standard; Drain to Source Voltage (Vdss): 30V; Current - Continuous Drain (Id) @ 25°C: 500mA (Ta); Rds On (Max) @ Id, Vgs: 1.5 Ohm @ 10mA, 4V; Vgs(th) (Max) @ Id: 1.4V @ 250µA; Gate Charge (Qg) @ Vgs: 1.15nC @ 5V; Input Capacitance (Ciss) @ Vds: 21pF @ 5V; Power - Max: 690mW; Supplier 1: Digi-Key; Supplier Part Number 1: NTR4003NT1GOSCT-ND; Manufacturer Part Number: NTR4003NT1G; RoHS: RoHS Compliant; Category: Discrete Semiconductor Products; Stock 1: 65978; Pricing 1: 1=0.27, 10=0.223, 100=0.118, 500=0.07758, 1000=0.05286 (USD); Packaging: Cut Tape (CT); Operating Temperature: -55°C ~ 150°C (TJ); Mounting Type: Surface Mount; Package / Case: TO-236-3, SC-59, SOT-23-3; Supplier Device Package: SOT-23-3 (TO-236); ComponentLink1URL: http://www.onsemi.com/pub_link/Collateral/NTR4003N-D.PDF; ComponentLink1Description: http://www.onsemi.com/pub_link/Collateral/NTR4003N-D.PDF
R35 R36 R39 R40 = Res1: Resistor; Manufacturer: Yageo; Manufacturer Part Number: RC0603JR-07100KL; Description: RES SMD 100K OHM 5% 1/10W 0603; Tolerance: ±5%; Power (Watts): 0.1W, 1/10W; Temperature Coefficient: ±100ppm/°C; Published: 8-Jun-2000; LatestRevisionDate: 17-Jul-2002; LatestRevisionNote: Re-released for DXP Platform.; PackageReference: AXIAL-0.3; Publisher: Altium Limited; PackageDescription: Axial Device, Thru-Hole; 2 Leads; 0.3 in Pin Spacing; Value: 100K; Supplier 1: Digi-Key; Supplier Part Number 1: 311-100KGRCT-ND; RoHS: RoHS Compliant; Category: Resistors; Stock 1: 1162719; Pricing 1: 1=0.1, 10=0.011, 25=0.008, 100=0.0044, 250=0.00336, 500=0.0027, 1000=0.00198, 2500=0.00172 (USD); Packaging: Cut Tape (CT); Resistance (Ohms): 100k; Composition: Thick Film; Features: Moisture Resistant; Operating Temperature: -55°C ~ 155°C; Package / Case: 0603 (1608 Metric); Supplier Device Package: 0603; Size / Dimension: 0.063" L x 0.031" W (1.60mm x 0.80mm); Height: 0.022" (0.55mm); Number of Terminations: 2; ComponentLink1URL: http://www.yageo.com/documents/recent/PYu-RC_Group_51_RoHS_L_04.pdf; ComponentLink1Description: http://www.yageo.com/documents/recent/PYu-RC_Group_51_RoHS_L_04.pdf
R37 R38 R41 R42 = Res1: as R22 on sheet current_sense; Published: 8-Jun-2000; LatestRevisionDate: 17-Jul-2002; LatestRevisionNote: Re-released for DXP Platform.; PackageReference: AXIAL-0.3; Publisher: Altium Limited; PackageDescription: Axial Device, Thru-Hole; 2 Leads; 0.3 in Pin Spacing; Value: 200; Supplier 1: Digi-Key; Supplier Part Number 1: 311-200GRCT-ND; RoHS: RoHS Compliant; Category: Resistors; Stock 1: 267996; Pricing 1: 1=0.1, 10=0.011, 25=0.008, 100=0.0044, 250=0.00336, 500=0.0027, 1000=0.00198, 2500=0.00172 (USD); Packaging: Cut Tape (CT); Resistance (Ohms): 200; Composition: Thick Film; Features: Moisture Resistant; Operating Temperature: -55°C ~ 155°C; Package / Case: 0603 (1608 Metric); Supplier Device Package: 0603; Size / Dimension: 0.063" L x 0.031" W (1.60mm x 0.80mm); Height: 0.022" (0.55mm); Number of Terminations: 2; ComponentLink1URL: http://www.yageo.com/documents/recent/PYu-RC_Group_51_RoHS_L_04.pdf; ComponentLink1Description: http://www.yageo.com/documents/recent/PYu-RC_Group_51_RoHS_L_04.pdf

## Sheet estop_circuitry.SchDoc
size Letter; CompanyName: Carnegie Mellon University; Organization: Carnegie Mellon University; Address1: Carnegie Mellon University; Address2: Robotics Institute; Address3: 5000 Forbes Ave., 4208 NSH; Address4: Pittsburgh, PA 15213; DocumentNumber: 3; Revision: 1.0; SheetNumber: 3; SheetTotal: 8; PageSetup: Record=PageOptions|CenterHorizontal=True|CenterVertical=True|PrintScale=1.00|XCorrection=1.00|YCorrection=1.00|PrintKind=0|BorderSize=5000000|LeftOffset=0|BottomOffset=0|Orientation=2|PaperLength=1000|PaperWidth=1000|Scale=100|PaperSource=7|PrintQuality=-4|MediaType=1|DitherType=10|PaperKind=Letter|PrintScaleMode=1
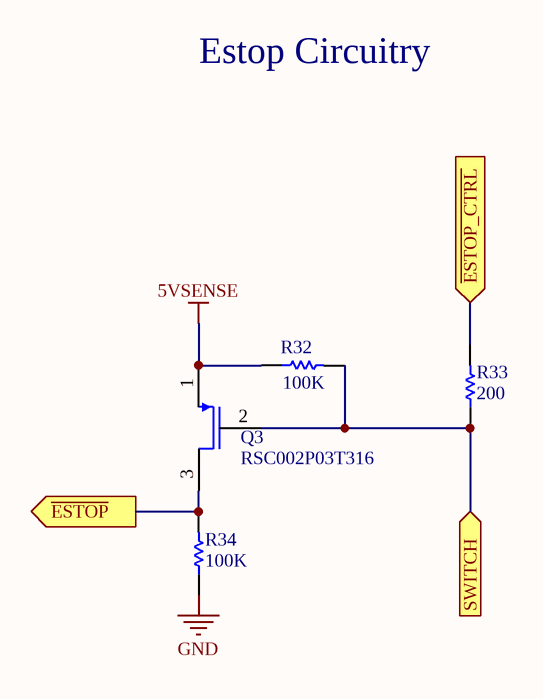
[diagram p6: estop_circuitry.SchDoc]

### Parts
Q3  RSC002P03T316  [SOT-23]
R32  100K  [RESC1608N]
R33  200  [RESC1608N]
R34  100K  [RESC1608N]

### Ports
SWITCH (in), ~{ESTOP_CTRL} (in), ~{ESTOP} (out)

### Nets
5VSENSE: Q3.1 R32.1
GND: R34.1
~{ESTOP}: Q3.3 R34.2 ; port ~{ESTOP}
SWITCH: Q3.2 R32.2 R33.1 ; port SWITCH
NetR33_2: R33.2 ; port ~{ESTOP_CTRL}

### Notes on the sheet
- Estop Circuitry
- Title
- Size:
- Date:
- Letter
- Number:
- Time:
- Revision:
- Sheet
- of
- File:

### Library data of the parts
Q3 = RSC002P03T316: P-Channel MOSFET; pin to pad: 1>2 2>1; Manufacturer: Rohm Semiconductor; Description: MOSFET P-CH 30V 0.25A SST3; FET Type: MOSFET P-Channel, Metal Oxide; FET Feature: Logic Level Gate, 4V Drive; Drain to Source Voltage (Vdss): 30V; Current - Continuous Drain (Id) @ 25°C: 250mA (Ta); Rds On (Max) @ Id, Vgs: 1.4 Ohm @ 250mA, 10V; Vgs(th) (Max) @ Id: 2.5V @ 1mA; Input Capacitance (Ciss) @ Vds: 30pF @ 10V; Power - Max: 200mW; Supplier 1: Digi-Key; Supplier Part Number 1: RSC002P03T316CT-ND; Manufacturer Part Number: RSC002P03T316; RoHS: RoHS Compliant; Category: Discrete Semiconductor Products; Stock 1: 8983; Pricing 1: 1=0.27, 10=0.222, 100=0.1174, 500=0.0772, 1000=0.0526 (USD); Packaging: Cut Tape (CT); Gate Charge (Qg) @ Vgs: -; Operating Temperature: 150°C (TJ); Mounting Type: Surface Mount; Package / Case: TO-236-3, SC-59, SOT-23-3; Supplier Device Package: SST3; ComponentLink1URL: http://rohmfs.rohm.com/en/products/databook/datasheet/discrete/transistor/mosfet/rsc002p03.pdf; ComponentLink1Description: http://rohmfs.rohm.com/en/products/databook/datasheet/discrete/transistor/mosfet/rsc002p03.pdf
R32 R34 = Res1: as R35 on sheet fan_control; Published: 8-Jun-2000; LatestRevisionDate: 17-Jul-2002; LatestRevisionNote: Re-released for DXP Platform.; PackageReference: AXIAL-0.3; Publisher: Altium Limited; PackageDescription: Axial Device, Thru-Hole; 2 Leads; 0.3 in Pin Spacing; Value: 100K; Supplier 1: Digi-Key; Supplier Part Number 1: 311-100KGRCT-ND; RoHS: RoHS Compliant; Category: Resistors; Stock 1: 1162719; Pricing 1: 1=0.1, 10=0.011, 25=0.008, 100=0.0044, 250=0.00336, 500=0.0027, 1000=0.00198, 2500=0.00172 (USD); Packaging: Cut Tape (CT); Resistance (Ohms): 100k; Composition: Thick Film; Features: Moisture Resistant; Operating Temperature: -55°C ~ 155°C; Package / Case: 0603 (1608 Metric); Supplier Device Package: 0603; Size / Dimension: 0.063" L x 0.031" W (1.60mm x 0.80mm); Height: 0.022" (0.55mm); Number of Terminations: 2; ComponentLink1URL: http://www.yageo.com/documents/recent/PYu-RC_Group_51_RoHS_L_04.pdf; ComponentLink1Description: http://www.yageo.com/documents/recent/PYu-RC_Group_51_RoHS_L_04.pdf
R33 = Res1: as R22 on sheet current_sense; Published: 8-Jun-2000; LatestRevisionDate: 17-Jul-2002; LatestRevisionNote: Re-released for DXP Platform.; PackageReference: AXIAL-0.3; Publisher: Altium Limited; PackageDescription: Axial Device, Thru-Hole; 2 Leads; 0.3 in Pin Spacing; Value: 200; Supplier 1: Digi-Key; Supplier Part Number 1: 311-200GRCT-ND; RoHS: RoHS Compliant; Category: Resistors; Stock 1: 267996; Pricing 1: 1=0.1, 10=0.011, 25=0.008, 100=0.0044, 250=0.00336, 500=0.0027, 1000=0.00198, 2500=0.00172 (USD); Packaging: Cut Tape (CT); Resistance (Ohms): 200; Composition: Thick Film; Features: Moisture Resistant; Operating Temperature: -55°C ~ 155°C; Package / Case: 0603 (1608 Metric); Supplier Device Package: 0603; Size / Dimension: 0.063" L x 0.031" W (1.60mm x 0.80mm); Height: 0.022" (0.55mm); Number of Terminations: 2; ComponentLink1URL: http://www.yageo.com/documents/recent/PYu-RC_Group_51_RoHS_L_04.pdf; ComponentLink1Description: http://www.yageo.com/documents/recent/PYu-RC_Group_51_RoHS_L_04.pdf

## Sheet io_connectors.SchDoc
size Letter; CompanyName: Carnegie Mellon University; Organization: Carnegie Mellon University; Address1: Carnegie Mellon University; Address2: Robotics Institute; Address3: 5000 Forbes Ave., 4208 NSH; Address4: Pittsburgh, PA 15213; DocumentNumber: 8; Revision: 1.0; SheetNumber: 8; SheetTotal: 8; PageSetup: Record=PageOptions|CenterHorizontal=True|CenterVertical=True|PrintScale=1.00|XCorrection=1.00|YCorrection=1.00|PrintKind=0|BorderSize=5000000|LeftOffset=0|BottomOffset=0|Orientation=2|PaperLength=1000|PaperWidth=1000|Scale=100|PaperSource=7|PrintQuality=-4|MediaType=1|DitherType=10|PaperKind=Letter|PrintScaleMode=1
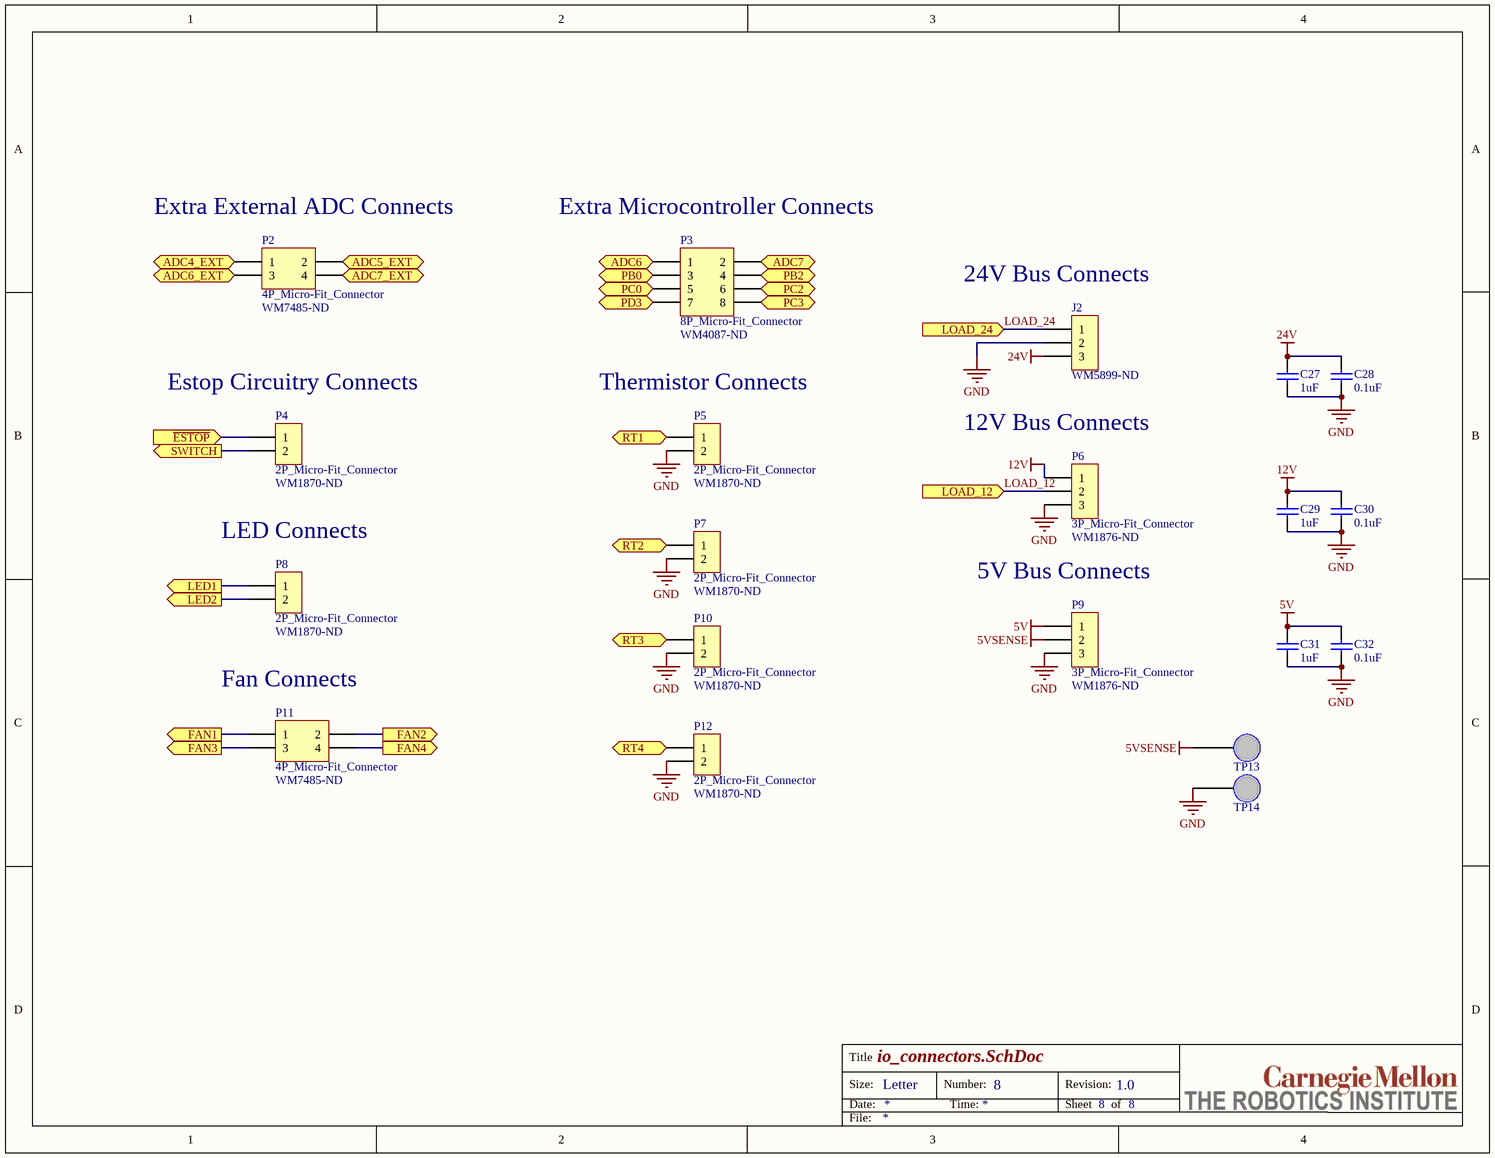
[diagram p7: io_connectors.SchDoc]

### Parts
C27  value 1uF  [CAPC1608N]  (hidden comment: Bypass, 24V, 1uF)
C28  value 0.1uF  [CAPC1608N]  (hidden comment: Bypass, 24V, 0.1uF)
C29  value 1uF  [CAPC1608N]  (hidden comment: Bypass, 12V, 1uF)
C30  value 0.1uF  [CAPC1608N]  (hidden comment: Bypass, 12V, 0.1uF)
C31  value 1uF  [CAPC1608N]  (hidden comment: Bypass, 5V, 1uF)
C32  value 0.1uF  [CAPC1608N]  (hidden comment: Bypass, 5V, 0.1uF)
J2  Supplier Part Number 1: WM5899-ND  [3P_Molex_Terminal_Block]  (hidden comment: Terminal Block)
P2  4P_Micro-Fit_Connector  Supplier Part Number 1: WM7485-ND  [4P_Micro-Fit_Header]
P3  8P_Micro-Fit_Connector  Supplier Part Number 1: WM4087-ND  [8P_Micro-Fit_Header]
P4  2P_Micro-Fit_Connector  Supplier Part Number 1: WM1870-ND  [2P_Micro-Fit_Header]
P5  2P_Micro-Fit_Connector  Supplier Part Number 1: WM1870-ND  [2P_Micro-Fit_Header]
P6  3P_Micro-Fit_Connector  Supplier Part Number 1: WM1876-ND  [3P_Micro-Fit_Header]
P7  2P_Micro-Fit_Connector  Supplier Part Number 1: WM1870-ND  [2P_Micro-Fit_Header]
P8  2P_Micro-Fit_Connector  Supplier Part Number 1: WM1870-ND  [2P_Micro-Fit_Header]
P9  3P_Micro-Fit_Connector  Supplier Part Number 1: WM1876-ND  [3P_Micro-Fit_Header]
P10  2P_Micro-Fit_Connector  Supplier Part Number 1: WM1870-ND  [2P_Micro-Fit_Header]
P11  4P_Micro-Fit_Connector  Supplier Part Number 1: WM7485-ND  [4P_Micro-Fit_Header]
P12  2P_Micro-Fit_Connector  Supplier Part Number 1: WM1870-ND  [2P_Micro-Fit_Header]
TP13  5V  [TestPoint]  (value not drawn)
TP14  GND  [TestPoint]  (value not drawn)

### Ports
ADC4_EXT (out), ADC5_EXT (out), ADC6 (out), ADC6_EXT (out), ADC7 (out), ADC7_EXT (out), FAN1 (out), FAN2 (out), FAN3 (out), FAN4 (out), LED1 (out), LED2 (out), LOAD_12 (in), LOAD_24 (in), PB0 (bidir), PB2 (bidir), PC0 (bidir), PC2 (bidir), PC3 (bidir), PD3 (bidir), RT1 (out), RT2 (out), RT3 (out), RT4 (out), SWITCH (out), ~{ESTOP} (in)

### Nets
5V: C31.2 C32.2 P9.1
5VSENSE: P9.2 TP13.1
12V: C29.2 C30.2 P6.1
24V: C27.2 C28.2 J2.3
GND: C27.1 C28.1 C29.1 C30.1 C31.1 C32.1 J2.2 P5.2 P6.3 P7.2 P9.3 P10.2 P12.2 TP14.1
ADC4_EXT: P2.1 ; port ADC4_EXT
ADC5_EXT: P2.2 ; port ADC5_EXT
ADC6_EXT: P2.3 ; port ADC6_EXT
ADC7_EXT: P2.4 ; port ADC7_EXT
~{ESTOP}: P4.1 ; port ~{ESTOP}
FAN1: P11.1 ; port FAN1
FAN2: P11.2 ; port FAN2
FAN3: P11.3 ; port FAN3
FAN4: P11.4 ; port FAN4
LED1: P8.1 ; port LED1
LED2: P8.2 ; port LED2
LOAD_12: P6.2 ; port LOAD_12
LOAD_24: J2.1 ; port LOAD_24
RT1: P5.1 ; port RT1
RT2: P7.1 ; port RT2
RT3: P10.1 ; port RT3
RT4: P12.1 ; port RT4
SWITCH: P4.2 ; port SWITCH
NetP3_1: P3.1 ; port ADC6
NetP3_2: P3.2 ; port ADC7
NetP3_3: P3.3 ; port PB0
NetP3_4: P3.4 ; port PB2
NetP3_5: P3.5 ; port PC0
NetP3_6: P3.6 ; port PC2
NetP3_7: P3.7 ; port PD3
NetP3_8: P3.8 ; port PC3

### Notes on the sheet
- (near P2) Extra External ADC Connects
- (near P3) Extra Microcontroller Connects
- (near J2) 24V Bus Connects
- (near P4) Estop Circuitry Connects
- (near P5) Thermistor Connects
- 12V Bus Connects
- (near P8) LED Connects
- 5V Bus Connects
- (near P11) Fan Connects
- Title
- Size:
- Date:
- Letter
- Number:
- Time:
- Revision:
- Sheet
- of
- File:

### Library data of the parts
C27 C29 C31 = Cap: as C13 on sheet current_sense; Published: 8-Jun-2000; LatestRevisionDate: 17-Jul-2002; LatestRevisionNote: Re-released for DXP Platform.; PackageReference: RAD-0.3; Publisher: Altium Limited; PackageDescription: Radial Cap, Thru-Hole; 2 Leads; 0.3 in Pin Spacing; Supplier 1: Digi-Key; Supplier Part Number 1: 490-10732-1-ND; RoHS: RoHS Compliant; Category: Capacitors; Stock 1: 59223; Pricing 1: 1=0.17, 10=0.12, 50=0.069, 100=0.057, 250=0.048, 500=0.0402, 1000=0.033 (USD); Packaging: Cut Tape (CT); Mounting Type: Surface Mount, MLCC; Operating Temperature: -55°C ~ 85°C; Applications: General Purpose; Ratings: -; Package / Case: 0603 (1608 Metric); Size / Dimension: 0.063" L x 0.031" W (1.60mm x 0.80mm); Height - Seated (Max): -; Thickness (Max): 0.035" (0.90mm); Lead Spacing: -; Features: -; Lead Style: -; ComponentLink1URL: http://www.murata.com/~/media/webrenewal/support/library/catalog/products/capacitor/mlcc/c02e.pdf; ComponentLink1Description: http://www.murata.com/~/media/webrenewal/support/library/catalog/products/capacitor/mlcc/c02e.pdf
C28 C30 C32 = Cap: as C11 on sheet current_sense; Published: 8-Jun-2000; LatestRevisionDate: 17-Jul-2002; LatestRevisionNote: Re-released for DXP Platform.; PackageReference: RAD-0.3; Publisher: Altium Limited; PackageDescription: Radial Cap, Thru-Hole; 2 Leads; 0.3 in Pin Spacing; Supplier 1: Digi-Key; Supplier Part Number 1: 490-13406-1-ND; RoHS: RoHS Compliant; Category: Capacitors; Stock 1: 7465; Pricing 1: 1=0.11, 10=0.078, 50=0.0422, 100=0.0358, 250=0.02924, 500=0.02502, 1000=0.0195 (USD); Packaging: Cut Tape (CT); Mounting Type: Surface Mount, MLCC; Operating Temperature: -55°C ~ 125°C; Applications: General Purpose; Ratings: -; Package / Case: 0603 (1608 Metric); Size / Dimension: 0.063" L x 0.031" W (1.60mm x 0.80mm); Height - Seated (Max): -; Thickness (Max): 0.031" (0.80mm); Lead Spacing: -; Features: -; Lead Style: -; ComponentLink1URL: http://www.murata.com/~/media/webrenewal/support/library/catalog/products/capacitor/mlcc/c02e.pdf; ComponentLink1Description: http://www.murata.com/~/media/webrenewal/support/library/catalog/products/capacitor/mlcc/c02e.pdf
J2 = 3P_Molex_Beau_38660: Screw Terminal Block; Supplier 1: Digi-Key
P2 P11 = 4P_Micro-Fit_Connector: 4 Pin Microfit Connector; LatestRevisionDate: 17-Jul-2002; LatestRevisionNote: Re-released for DXP Platform.; Publisher: Altium Limited; Supplier 1: Digi-Key
P3 = 8P_Micro-Fit_Connector: 8-Pin Microfit Connector; LatestRevisionDate: 17-Jul-2002; LatestRevisionNote: Re-released for DXP Platform.; Publisher: Altium Limited; Supplier 1: Digi-Key
P4 P5 P7 P8 P10 P12 = 2P_Micro-Fit_Connector: 2 Pin Microfit Connector; Manufacturer: Molex, LLC; Manufacturer Part Number: 0436500203; Connector Type: Header, Shrouded; Number of Positions: 2; Number of Positions Loaded: All; Pitch: 0.118" (3.00mm); Supplier 1: Digi-Key; RoHS: RoHS Compliant; Category: Connectors, Interconnects; Stock 1: 11989; Pricing 1: 1=0.99, 10=0.867, 50=0.7818, 100=0.7478, 250=0.6798, 500=0.61182, 1000=0.54384, 2500=0.49286, 5000=0.47586 (USD); Packaging: Tray; Contact Type: Male Pin; Number of Rows: 1; Row Spacing: -; Contact Mating Length: -; Mounting Type: Through Hole, Right Angle; Termination: Solder; Fastening Type: Locking Ramp; Features: Board Lock; Contact Finish: Tin; Contact Finish Thickness: 100µin (2.54µm); Color: Black; ComponentLink1URL: http://www.molex.com/pdm_docs/sd/436500203_sd.pdf; ComponentLink1Description: http://www.molex.com/pdm_docs/sd/436500203_sd.pdf
P6 P9 = 3P_Micro-Fit_Connector: 3 Pin Microfit Connector; Manufacturer: Molex, LLC; Manufacturer Part Number: 0436500304; Connector Type: Header, Shrouded; Number of Positions: 3; Number of Positions Loaded: All; Pitch: 0.118" (3.00mm); Supplier 1: Digi-Key; RoHS: RoHS Compliant; Category: Connectors, Interconnects; Stock 1: 19420; Pricing 1: 1=1.39, 25=1.152, 50=1.104, 100=1.056, 250=0.96, 500=0.864, 1000=0.768, 2500=0.696, 5000=0.672 (USD); Packaging: Tray; Contact Type: Male Pin; Number of Rows: 1; Row Spacing: -; Contact Mating Length: -; Mounting Type: Through Hole, Right Angle; Termination: Solder; Fastening Type: Locking Ramp; Features: Board Lock; Contact Finish: Gold; Contact Finish Thickness: 15µin (0.38µm); Color: Black; ComponentLink1URL: http://www.molex.com/pdm_docs/sd/436500304_sd.pdf; ComponentLink1Description: http://www.molex.com/pdm_docs/sd/436500304_sd.pdf
TP13 TP14 = Ring_Terminal: Test Point

## Nets that join several sheets
5V: current_sense (R17.1 R19.2 U4.8), io_connectors (C31.2 C32.2 P9.1)
5VSENSE: Arduino_mini (15 pins), current_sense (15 pins), thermal_monitor (10 pins), fan_control (R35.2 R36.2 R39.2 R40.2), estop_circuitry (Q3.1 R32.1), io_connectors (P9.2 TP13.1)
12V: current_sense (R27.1 R28.2 U5.8), io_connectors (C29.2 C30.2 P6.1)
24V: current_sense (R16.1 R18.2 U3.8), io_connectors (C27.2 C28.2 J2.3)
GND: Arduino_mini (21 pins), current_sense (12 pins), thermal_monitor (12 pins), led_control (Q8.3 Q9.3), fan_control (Q4.3 Q5.3 Q6.3 Q7.3), estop_circuitry (R34.1), io_connectors (14 pins)
ADC4_EXT: thermal_monitor (U6.5), io_connectors (P2.1)
ADC5_EXT: thermal_monitor (U6.6), io_connectors (P2.2)
ADC6_EXT: thermal_monitor (U6.7), io_connectors (P2.3)
ADC7_EXT: thermal_monitor (U6.8), io_connectors (P2.4)
~{ESTOP}: estop_circuitry (Q3.3 R34.2), io_connectors (P4.1)
FAN1: fan_control (Q4.1), io_connectors (P11.1)
FAN2: fan_control (Q5.1), io_connectors (P11.2)
FAN3: fan_control (Q6.1), io_connectors (P11.3)
FAN4: fan_control (Q7.1), io_connectors (P11.4)
FAN_CTRL: Arduino_mini (U1.9), fan_control (8 pins)
LED1: led_control (R43.1), io_connectors (P8.1)
LED2: led_control (R44.2), io_connectors (P8.2)
LOAD_12: current_sense (R28.1 R29.1), io_connectors (P6.2)
LOAD_24: current_sense (R18.1 R20.1), io_connectors (J2.1)
NetP3_1: Arduino_mini (U1.19), io_connectors (P3.1)
NetP3_2: Arduino_mini (U1.22), io_connectors (P3.2)
NetP3_3: Arduino_mini (U1.12), io_connectors (P3.3)
NetP3_4: Arduino_mini (U1.14), io_connectors (P3.4)
NetP3_5: Arduino_mini (U1.23), io_connectors (P3.5)
NetP3_6: Arduino_mini (U1.25), io_connectors (P3.6)
NetP3_7: Arduino_mini (U1.1), io_connectors (P3.7)
NetP3_8: Arduino_mini (U1.26), io_connectors (P3.8)
NetQ8_2: Arduino_mini (U1.10), led_control (Q8.2)
NetQ9_2: Arduino_mini (U1.13), led_control (Q9.2)
NetR14_2: Arduino_mini (U1.32), current_sense (R14.2 U3.3)
NetR15_2: Arduino_mini (U1.24), current_sense (R15.2 U4.3)
NetR26_2: Arduino_mini (U1.2), current_sense (R26.2 U5.3)
NetR33_2: Arduino_mini (U1.11), estop_circuitry (R33.2)
RT1: thermal_monitor (R45.1 R47.2), io_connectors (P5.1)
RT2: thermal_monitor (R46.1 R48.2), io_connectors (P7.1)
RT3: thermal_monitor (R51.1 R53.2), io_connectors (P10.1)
RT4: thermal_monitor (R52.1 R54.2), io_connectors (P12.1)
SCL: Arduino_mini (R4.1 TP2.1 U1.28), current_sense (R24.2 R25.2 R31.2), thermal_monitor (R49.1)
SDA: Arduino_mini (R3.1 TP1.1 U1.27), current_sense (R22.2 R23.2 R30.2), thermal_monitor (R50.1)
SWITCH: estop_circuitry (Q3.2 R32.2 R33.1), io_connectors (P4.2)